# Altium schematic sheet Gate Drive.SchDoc
size 406 x 304 mm; SheetNumber: 6; SheetTotal: 10
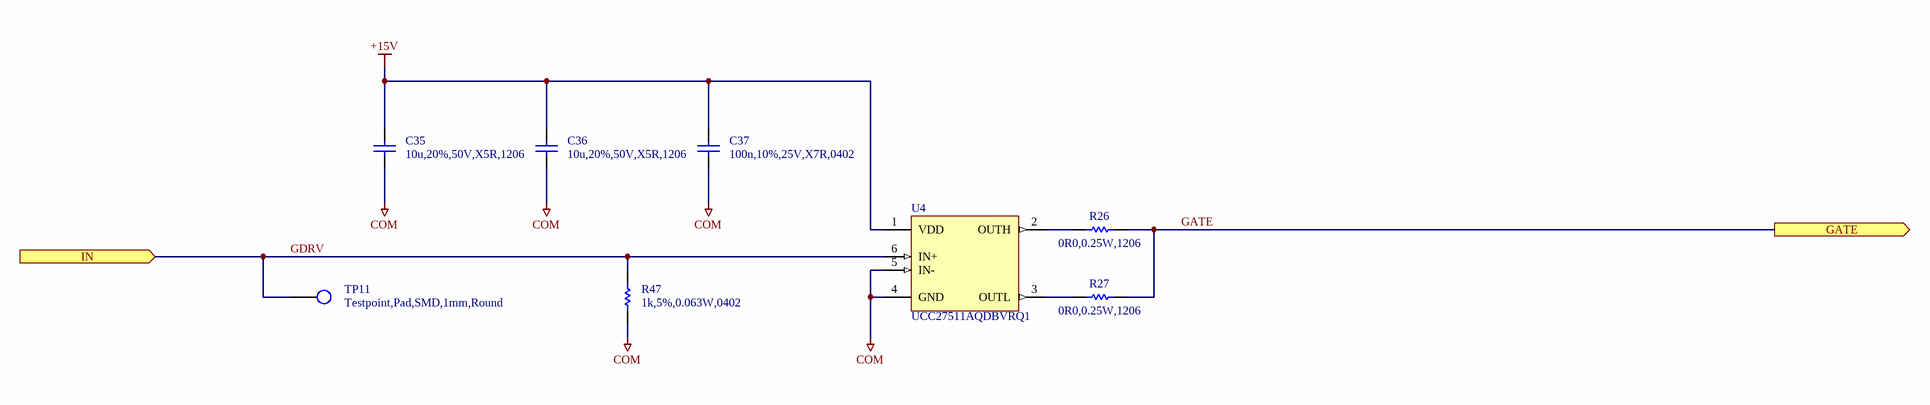
[diagram p0: Gate Drive.SchDoc]

## Parts
C35  10u,20%,50V,X5R,1206  [CAPC3216X16N]
C36  10u,20%,50V,X5R,1206  [CAPC3216X16N]
C37  100n,10%,25V,X7R,0402  [CAPC1005X06N]
R26  0R0,0.25W,1206  [RESC3216X06N]
R27  0R0,0.25W,1206  [RESC3216X06N]
R47  1k,5%,0.063W,0402  [RESC1005X04N]
TP11  Testpoint,Pad,SMD,1mm,Round  [TP100]
U4  UCC27511AQDBVRQ1  [SOTFL95P260X145-6]

## Ports
GATE (out), IN (in)

## Nets
+15V: C35.2 C36.2 C37.2 U4.1(VDD)
COM: C35.1 C36.1 C37.1 R47.1 U4.4(GND) U4.5(IN-)
GATE: R26.2 R27.2 ; port GATE
GDRV: R47.2 TP11.1(TP) U4.6(IN+) ; port IN
NetR26_1: R26.1 U4.2(OUTH)
NetR27_1: R27.1 U4.3(OUTL)

## Notes on the sheet
- Sheet Name:
- Date:
- Sheet
- Designer:
- of

## Library data of the parts
C35 C36 = CAP,Cer,10uF,50VDC,X5R,1206: 10ï¿½F ï¿½20% 50V Ceramic Capacitor X5R 1206 (3216 Metric); Manufacturer 1: Samsung Electro-Mechanics; Manufacturer 1 Part Number: CL31A106MBHNNNE; Vendor 1 Part Number: 1276-6736-1-ND; Vendor 1: Digikey; Part Name: CAP,Cer,10uF,50VDC,X5R,1206; CreatedBy: Judd Foster; HelpURL: https://www.samsungsem.com/resources/file/global/support/product_catalog/MLCC.pdf; Value: 10u
C37 = CAP,Cer,100nF,10%,25V,X7R,0402: 0.1ï¿½F ï¿½10% 25V Ceramic Capacitor X7R 0402 (1005 Metric); Manufacturer 1: Murata Electronics; Manufacturer 1 Part Number: GRM155R71E104KE14J; Vendor 1 Part Number: 490-14603-1-ND; Vendor 1: DigiKey; Value: 100nF; Part Name: CAP,Cer,100nF,10%,25V,X7R,0402; CreatedBy: Judd Foster; HelpURL: https://search.murata.co.jp/Ceramy/image/img/A01X/G101/ENG/GRM155R71E104KE14-01.pdf
R26 R27 = RES,0R0,0.25W,1206: 0 Ohms Jumper Chip Resistor 1206 (3216 Metric) Automotive AEC-Q200 Thick Film; Manufacturer 1: Stackpole Electronics Inc; Manufacturer 1 Part Number: RMCF1206ZT0R00; Vendor 1 Part Number: RMCF1206ZT0R00CT-ND; Vendor 1: Digikey; Value: 0R; Part Name: RES,0R0,0.25W,1206; CreatedBy: Judd Foster; HelpURL: https://www.seielect.com/catalog/sei-rmcf_rmcp.pdf
R47 = RES,1k,5%,0.063W,0402: 1 kOhms ï¿½5% 0.063W, 1/16W Chip Resistor 0402 (1005 Metric) Automotive AEC-Q200 Thick Film; Manufacturer 1: Stackpole Electronics Inc; Manufacturer 1 Part Number: RMCF0402JT1K00; Vendor 1 Part Number: RMCF0402JT1K00CT-ND; Vendor 1: DIgikey; Part Name: RES,1k,5%,0.063W,0402; CreatedBy: Judd Foster; HelpURL: https://www.seielect.com/catalog/sei-rmcf_rmcp.pdf; Value: 1k
TP11 = Testpoint,Pad,SMD: PCB Testpoint 1mm Round; Part Name: Testpoint,Pad,SMD; CreatedBy: Judd Foster; HelpURL: N/A; Manufacturer 1: N/A; Manufacturer 1 Part Number: N/A; Vendor 1: N/A; Vendor 1 Part Number: N/A
U4 = UCC27511AQDBVRQ1: Gate Drivers Sngl-Ch high-Spd Low-Side Gate Driver; Manufacturer 1: Texas Instruments; Vendor 1 Part Number: 595-UCC27511AQDBVRQ1; Vendor 1: Mouser; Part Name: UCC27511AQDBVRQ1; CreatedBy: Judd Foster; HelpURL: https://www.ti.com/general/docs/suppproductinfo.tsp?distId=26&gotoUrl=https://www.ti.com/lit/gpn/ucc27511a-q1; Manufacturer 1 Part Number: UCC27511AQDBVRQ1